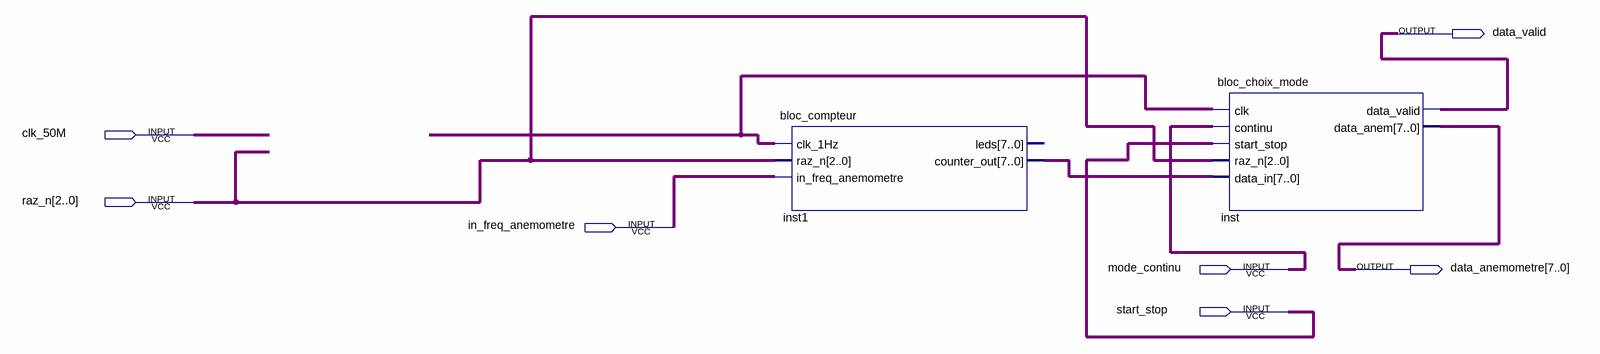
[diagram p0: schematic sheet]
// Quartus schematic schemaCompteurDiviseur.bdf as structural Verilog: 2 symbols, 7 pins
module schemaCompteurDiviseur (
  input  clk_50M,
  input  [2:0] raz_n,
  input  in_freq_anemometre,
  input  mode_continu,
  input  start_stop,
  output data_valid,
  output [7:0] data_anemometre
);

  wire undriven;
  wire [7:0] inst1_counter_out;

  bloc_compteur inst1 (
    .clk_1Hz(undriven), .raz_n(raz_n), .in_freq_anemometre(in_freq_anemometre),
    .counter_out(inst1_counter_out));  // open: leds
  bloc_choix_mode inst (
    .clk(undriven), .continu(mode_continu), .start_stop(start_stop), .raz_n(raz_n),
    .data_in(inst1_counter_out), .data_valid(data_valid), .data_anem(data_anemometre));
endmodule
